# EAGLE design SK_1.0v (EAGLE 7.5.0)
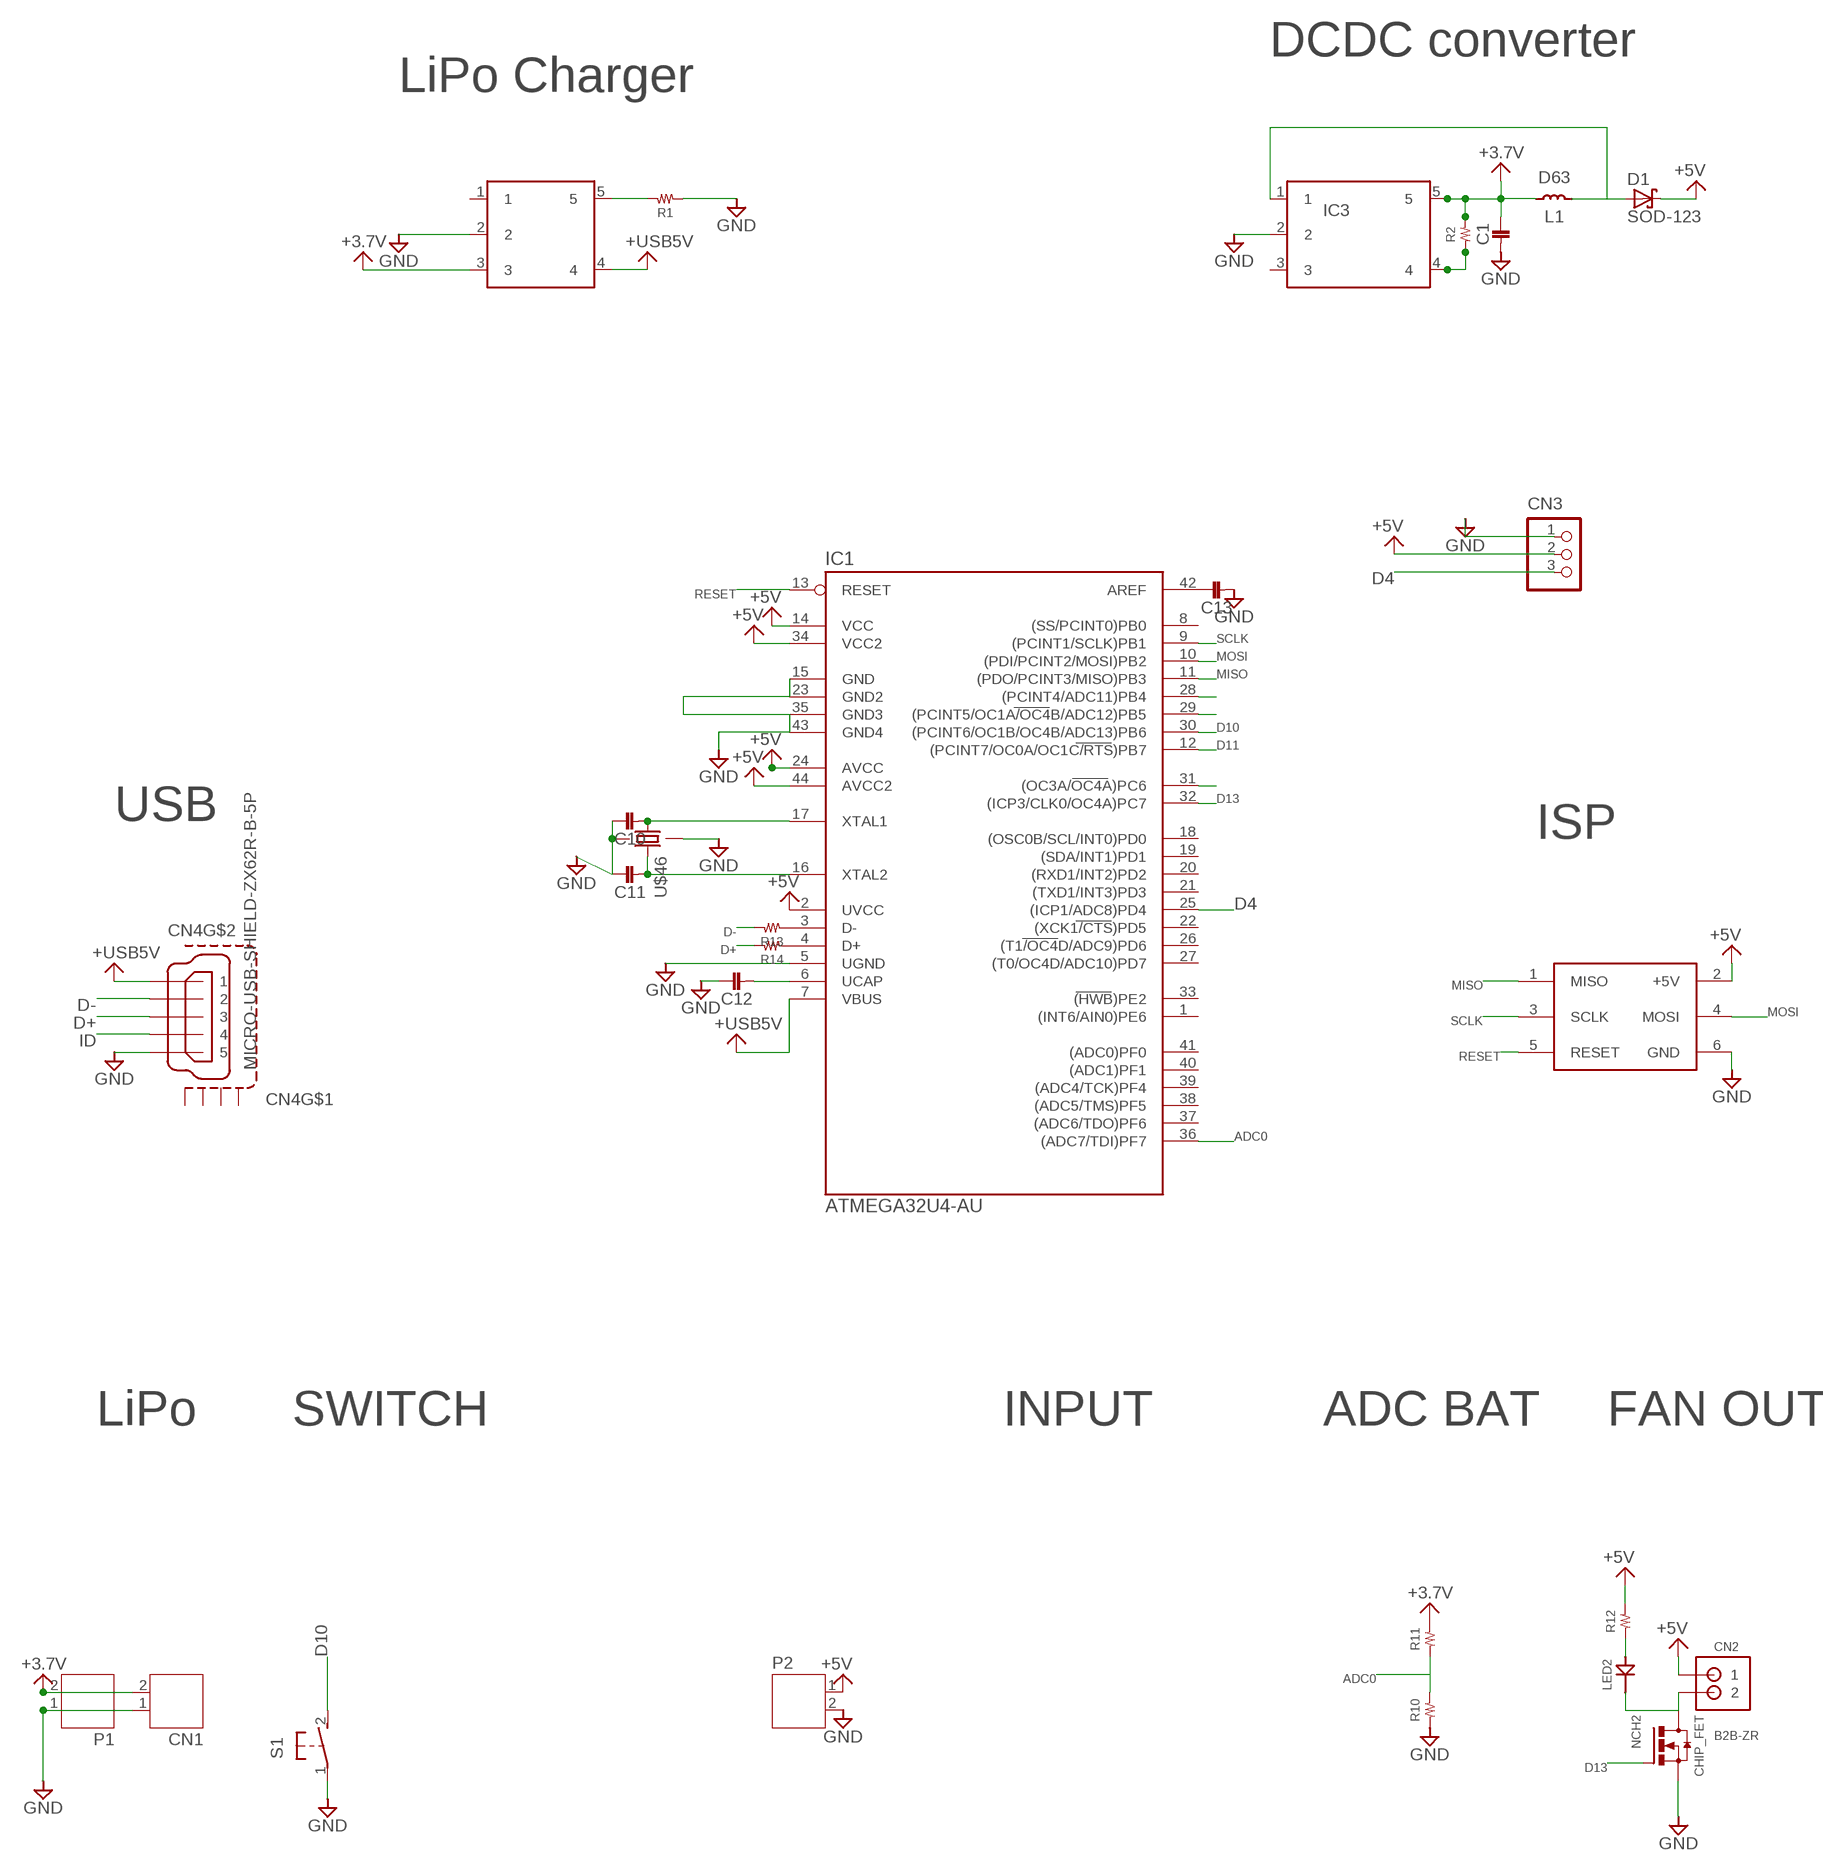
[diagram p0: schematic, sheet 1]

## Parts
C1  1608  [1608]
C10  1608  [1608]
C11  1608  [1608]
C12  1608  [1608]
C13  1608  [1608]
CN1  JST-PH2  [JST-PH2]
CN2  B2B-ZR  [B2B-ZR]
CN3  B3B-PH-K-S  [B3B-PH-K-S]
CN4  MICRO-USB-SHIELD-ZX62R-B-5P  [ZX62R-B-5P]
D1  SOD-123  [SOD_123]
IC1  ATMEGA32U4-AU  [TQFP44]
IC2  MCP73831  [SOT23-5L]
IC3  LM2735  [SOT23-5L]
L1  D63  [TOKO]
LED2  5MMLED  [5MM]
NCH2  CHIP_FET  [SOT23]
P1  JST-PH2  [JST-PH2]
P2  JST-PH2  [JST-PH2]
R1  RESISTOR__SMD  [1608]
R2  RESISTOR__SMD  [1608]
R10  RESISTOR__SMD  [1608]
R11  RESISTOR__SMD  [1608]
R12  RESISTOR__SMD  [1608]
R13  RESISTOR__SMD  [1608]
R14  RESISTOR__SMD  [1608]
S1  31-XX  [B3F-31XX]
U$3  ICSP  [ICSP]
U$46  FA-238  [FA-238]

## Nets
+3.7V: C1.P$1 CN1.2 IC2.3 IC3.5 L1.1 P1.2 R2.2 R11.2
+5V: CN2.1 CN3.2 D1.C IC1.2(UVCC) IC1.14(VCC) IC1.24(AVCC) IC1.34(VCC2) IC1.44(AVCC2) P2.1 R12.2 U$3.2(+5V)
+USB5V: CN4.1 IC1.7(VBUS) IC2.4
ADC0: IC1.36((ADC7/TDI)PF7) R10.2 R11.1
D4: CN3.3 IC1.25((ICP1/ADC8)PD4)
D10: IC1.30((PCINT6/OC1B/OC4B/ADC13)PB6) S1.2(S)
D11: IC1.12((PCINT7/OC0A/OC1C/RTS)PB7)
D13: IC1.32((ICP3/CLK0/OC4A)PC7) NCH2.1(G)
D+: CN4.3 R14.2
D-: CN4.2 R13.2
GND: C1.P$2 C10.P$1 C11.P$1 C12.P$1 C13.P$2 CN1.1 CN3.1 CN4.5 IC1.5(UGND) IC1.15(GND) IC1.23(GND2) IC1.35(GND3) IC1.43(GND4) IC2.2 IC3.2 NCH2.2(S) P1.1 P2.2 R1.1 R10.1 S1.1(P) U$3.6(GND) U$46.2 U$46.4
ID: CN4.4
MISO: IC1.11((PDO/PCINT3/MISO)PB3) U$3.1(MISO)
MOSI: IC1.10((PDI/PCINT2/MOSI)PB2) U$3.4(MOSI)
N$1: CN2.2 LED2.K NCH2.3(D)
N$2: IC2.5 R1.2
N$3: IC3.4 R2.1
N$4: D1.A IC3.1 L1.2
N$8: IC1.3(D-) R13.1
N$9: C13.P$1 IC1.42(AREF)
N$11: C10.P$2 IC1.17(XTAL1) U$46.1
N$12: LED2.A R12.1
N$13: C11.P$2 IC1.16(XTAL2) U$46.3
N$14: IC1.4(D+) R14.1
N$15: IC1.29((PCINT5/OC1A/OC4B/ADC12)PB5)
N$16: IC1.28((PCINT4/ADC11)PB4)
N$17: IC1.31((OC3A/OC4A)PC6)
N$18: C12.P$2 IC1.6(UCAP)
RESET: IC1.13(RESET) U$3.5(RESET)
SCLK: IC1.9((PCINT1/SCLK)PB1) U$3.3(SCLK)
Unconnected: CN4.M1(S1) CN4.M2(S2) CN4.M3(S3) CN4.M4(S4) IC1.1((INT6/AIN0)PE6) IC1.8((SS/PCINT0)PB0) IC1.18((OSC0B/SCL/INT0)PD0) IC1.19((SDA/INT1)PD1) IC1.20((RXD1/INT2)PD2) IC1.21((TXD1/INT3)PD3) IC1.22((XCK1/CTS)PD5) IC1.26((T1/OC4D/ADC9)PD6) IC1.27((T0/OC4D/ADC10)PD7) IC1.33((HWB)PE2) IC1.37((ADC6/TDO)PF6) IC1.38((ADC5/TMS)PF5) IC1.39((ADC4/TCK)PF4) IC1.40((ADC1)PF1) IC1.41((ADC0)PF0) IC2.1 IC3.3

## Notes on the sheet
- DCDC converter
- LiPo Charger
- USB
- ISP
- LiPo | SWITCH | INPUT | ADC BAT | FAN OUT

## Library data of the parts
C1 C10-C13 = 02_C:1608
CN1 = jst-ph (1):JST-PH2
CN2 = jst:B2B-ZR
CN3 = jst-ph:B3B-PH-*: Wire-to-Board 2.0mm pitch top mount connector Source: http://www.jst-mfg.com/product/pdf/jpn/PH.pdf http://www.jst-mfg.com/product/detail.php?series=199
CN4 = con-hirose1:MICRO-USB-SHIELD-: Hirose Micro USB Connector ZX62R-B-5P: Micro B, reverse (top mount) shell SMT Supplier: DigiKey H11574CT-ND Source: http://www.hirose.co.jp/cataloge_hp/e24200011.pdf
D1 = 15_DIODE:SOD-123
IC1 = mega32U4:ATMEGA32U4-AU
IC2 = 04_IC:MCP73831
IC3 = 04_IC:LM2735
L1 = 03_L:D63
LED2 = 10_LED:5MMLED
NCH2 = 06_FET:CHIP_FET
P1 P2 = jst-ph (2):JST-PH2
R1 R2 R10-R14 = 01_R:RESISTOR__SMD
S1 = switch-omron:31-XX: OMRON SWITCH; MPN: B3F-3100; OC_FARNELL: 959704; OC_NEWARK: 36M3582
U$3 = 08_CONECTOR:ICSP
U$46 = 09_2_CRYSTAL:FA-238

## Board
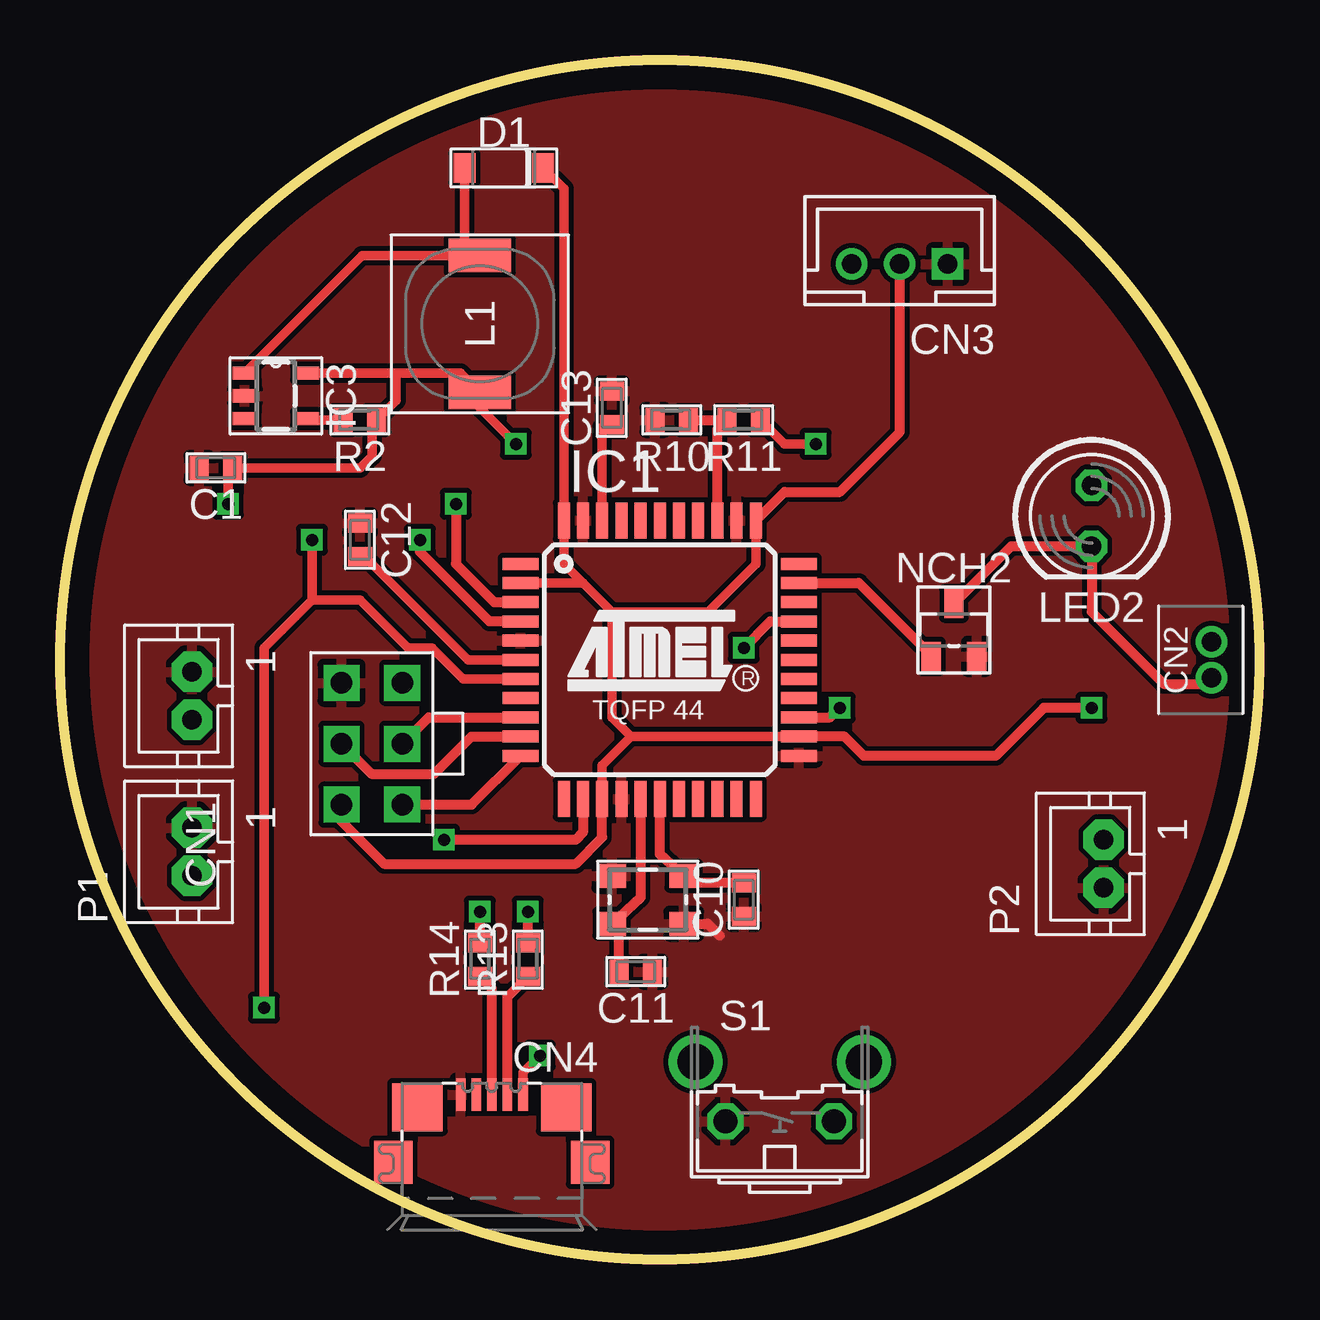
[diagram p1: board, top side]
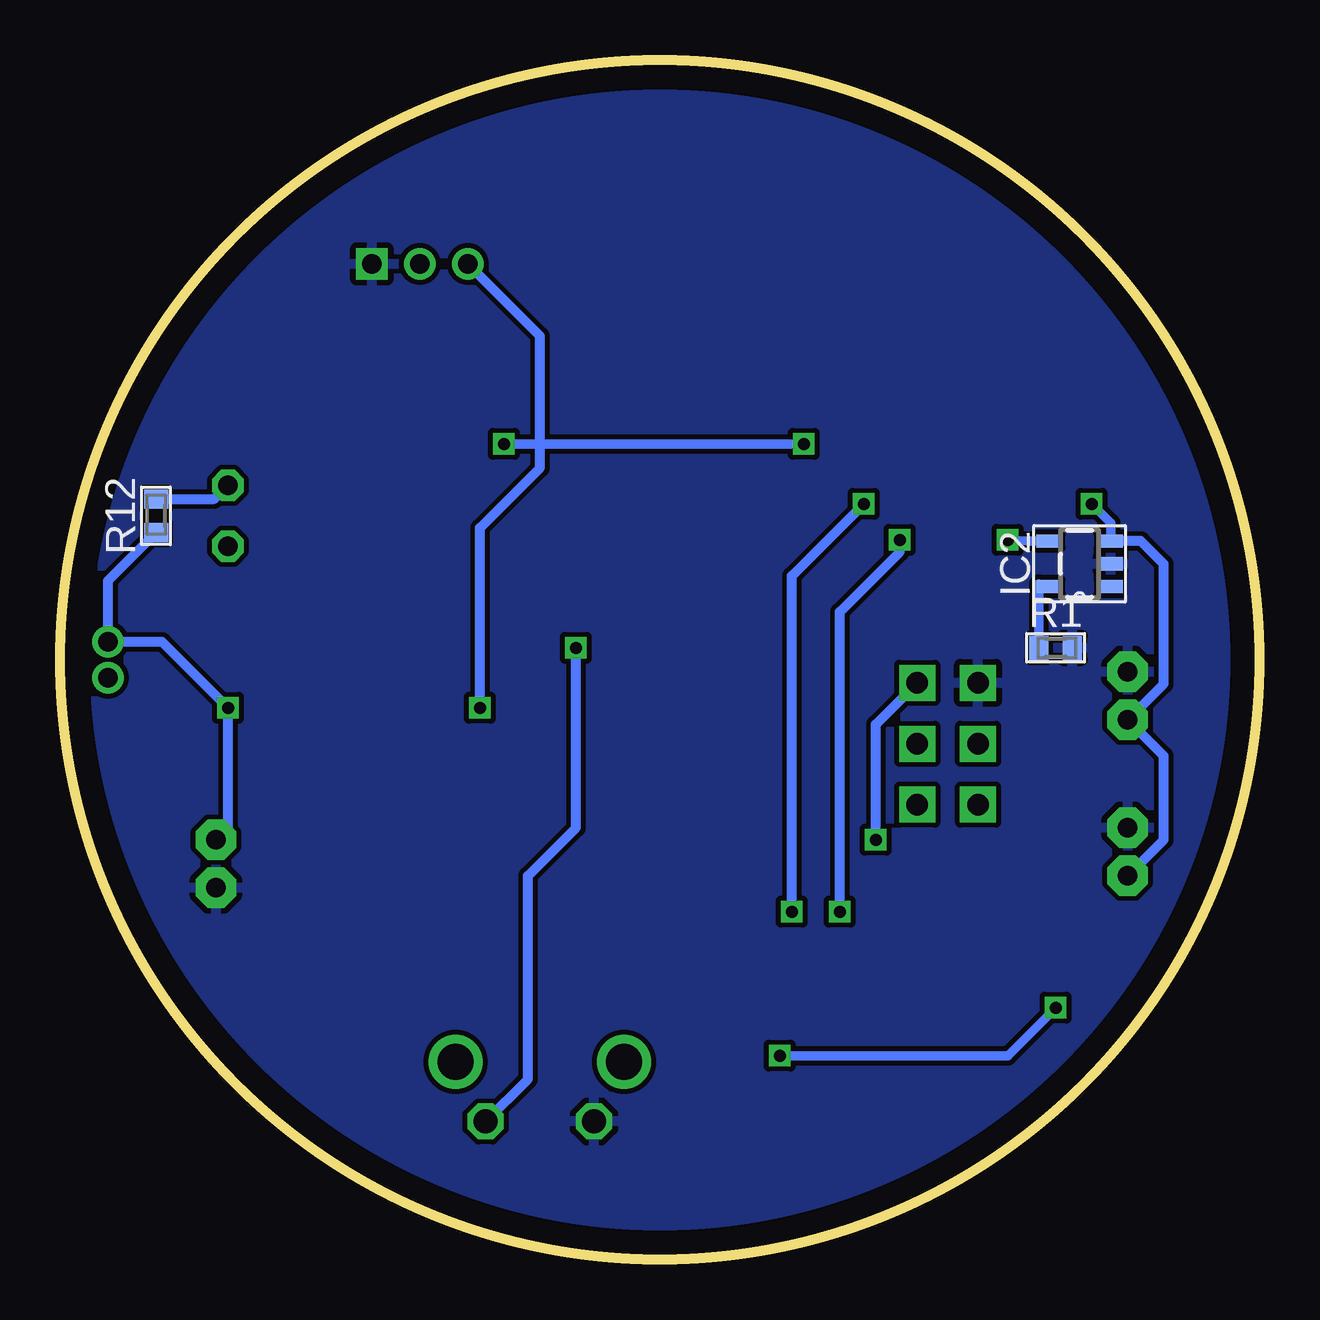
[diagram p2: board, bottom side, seen from below]

Size 50 x 50 mm. Coordinates in mm from the lower left corner, seen from the top.
Outline: circle at 25,25 radius 25
Copper layers (1*16): Top 0.035mm / dielectric 1.5mm / Bottom 0.035mm
Design rules "default": minimum track width 10mil, minimum drill 24mil, track to track 8mil, track to pad 8mil, pad to pad 8mil, via to via 8mil, smd to smd 8mil, copper to edge 40mil, drill to drill 8mil, minimum pad ring 10mil, minimum via ring 8mil, stop-mask expansion 4mil, vias tented up to drill 0mil, thermal gap 10mil

### Footprints (pad centres in the part's own frame; a part is rotated, then mirrored left to right if it is on the bottom)
1608 = smd 0.8 x 1: P$1 -0.7,0; P$2 0.7,0
JST-PH2 = drill 0.8 pad 1.676 octagon: 1 1,0; 2 -1,0
B2B-ZR = drill 0.8 pad 1.1: 1 -0.75,0; 2 0.75,0
B3B-PH-K-S = drill 0.8 square: 1 -2,0 | drill 0.8: 2 0,0; 3 2,0
ZX62R-B-5P = smd 1.35 x 0.4: 1 2.875,-1.3; 2 2.875,-0.65; 3 2.875,0; 4 2.875,0.65; 5 2.875,1.3 | smd 1.8 x 1.6: M1 0.05,-4.1; M2 0.05,4.1 | smd 2 x 2.1: M3 2.35,3.1; M4 2.35,-3.1
SOD_123 = smd 0.915 x 1.22: A -1.64,0; C 1.64,0
TQFP44 = smd 1.5 x 0.5: 1 -5.8,4; 2 -5.8,3.2; 3 -5.8,2.4; 4 -5.8,1.6; 5 -5.8,0.8; 6 -5.8,0; 7 -5.8,-0.8; 8 -5.8,-1.6; 9 -5.8,-2.4; 10 -5.8,-3.2; 11 -5.8,-4; 23 5.8,-4; 24 5.8,-3.2; 25 5.8,-2.4; 26 5.8,-1.6; 27 5.8,-0.8; 28 5.8,0; 29 5.8,0.8; 30 5.8,1.6; 31 5.8,2.4; 32 5.8,3.2; 33 5.8,4 | smd 0.5 x 1.5: 12 -4,-5.8; 13 -3.2,-5.8; 14 -2.4,-5.8; 15 -1.6,-5.8; 16 -0.8,-5.8; 17 0,-5.8; 18 0.8,-5.8; 19 1.6,-5.8; 20 2.4,-5.8; 21 3.2,-5.8; 22 4,-5.8; 34 4,5.8; 35 3.2,5.8; 36 2.4,5.8; 37 1.6,5.8; 38 0.8,5.8; 39 0,5.8; 40 -0.8,5.8; 41 -1.6,5.8; 42 -2.4,5.8; 43 -3.2,5.8; 44 -4,5.8
SOT23-5L = smd 0.55 x 1: 1 -0.95,-1.3; 2 0,-1.3; 3 0.95,-1.3; 4 0.95,1.3; 5 -0.95,1.3
TOKO = smd 1.4 x 2.6: 1 -2.85,0; 2 2.85,0
5MM = drill 0.8 octagon: A 0,-1.27; K 0,1.27
SOT23 = smd 0.8 x 1.2: 1 -0.95,-1.1; 2 0.95,-1.1; 3 0,1.1
1608' = smd 0.8 x 1: 1 -0.7,0; 2 0.7,0
B3F-31XX = drill 1 octagon: 1 -2.261,-1.245; 2 2.261,-1.245 | drill 1.5 pad 2.159: 3 -3.505,1.245; 4 3.505,1.245
ICSP = drill 0.9 pad 1.5 square: 1 -1.27,2.54; 2 1.27,2.54; 3 -1.27,0; 4 1.27,0; 5 -1.27,-2.54; 6 1.27,-2.54
FA-238 = smd 1.2 x 1: 1 -1.5,-1; 2 1.5,-1; 3 1.5,1; 4 -1.5,1

### Placement (x,y rotation side)
C1  6.5,33 180 top
C10  28.5,15 90 top
C11  24,12 180 top
C12  12.5,30 270 top
C13  23,35.5 90 top
CN1  5.5,23.5 90 top
CN2  48,25 270 top
CN3  35,41.5 180 top
CN4  18,4 90 top
D1  18.5,45.5 0 top
IC1  25,25 0 top
IC2  7.5,29 90 bottom
IC3  9,36 270 top
L1  17.5,39 90 top
LED2  43,31 180 top
NCH2  37.26,26.24 0 top
P1  5.5,17 90 top
P2  43.5,16.5 90 top
R1  [1608']  8.5,25.5 180 bottom
R2  [1608']  12.5,35 0 top
R10  [1608']  25.5,35 0 top
R11  [1608']  28.5,35 0 top
R12  [1608']  46,31 270 bottom
R13  [1608']  19.5,12.5 270 top
R14  [1608']  17.5,12.5 270 top
S1  30,7 0 top
U$3  13,21.5 180 top
U$46  24.5,15 180 top

### Tracks (layer width: path | path; a pad name or v marks a point on that pad's centre or on a via)
+3.7V  (via drill 0.5)
  Top 0.4: IC3.5 14,36.95 | 14,36.95 16.7,36.95 L1.1 17.5,35.5 v19,34 | 14,36.95 14,35.8 R2.2 13,34.8 13,33.5 12.5,33 C1.P$1 7,32.8 v7,31.5 | v31.5,34 30.2,34 R11.2
  Bottom 0.4: IC2.3 6.2,30.7 v7,31.5 | v19,34 v31.5,34
  Bottom 0.406: P1.2 4,17.5 4,21 CN1.2 4,24 4,29 4.95,29.95 IC2.3
+5V  (via drill 0.5)
  Top 0.4: IC1.24 23.8,21.8 | 23.8,21.8 22.6,20.6 IC1.14 | 23.8,21.8 23,22.6 23,27 | 23,27 21.8,28.2 | 21.8,28.2 IC1.2 | 21.8,28.2 21,29 IC1.44 21,44.64 D1.C | 23,27 27,27 29,29 IC1.34
  Top 0.406: U$3.2 11.73,18.27 13.5,16.5 21.5,16.5 22.6,17.6 IC1.14 | v43,23 41,23 39,21 33.5,21 32.7,21.8 IC1.24 | IC1.34 30.2,32 32.5,32 35,34.5 CN3.2
  Bottom 0.406: R12.2 48,28.3 CN2.1 45.75,25.75 v43,23 43,18 P2.1
+USB5V  (via drill 0.5)
  Top 0.4: CN4.1 19.3,7.8 v20,8.5 | v8.5,10.5 8.5,25.5 10.5,27.5 | 10.5,27.5 12.5,27.5 14.5,25.5 15.5,25.5 16.8,24.2 IC1.7 | v10.5,30 10.5,27.5
  Bottom 0.4: v20,8.5 10.5,8.5 v8.5,10.5 | IC2.4 9.55,29.95 v10.5,30
ADC0
  Top 0.406: IC1.36 27.4,34.6 R11.1 R10.2
D4  (via drill 0.5)
  Top 0.406: IC1.25 32.1,22.6 v32.5,23
  Bottom 0.406: v32.5,23 32.5,30.5 30,33 30,38.5 CN3.3
D10  (via drill 0.5)
  Top 0.406: v28.5,25.5 29.6,26.6 IC1.30
  Bottom 0.406: S1.2 30.5,7.52 30.5,16 28.5,18 v28.5,25.5
D13
  Top 0.406: IC1.32 33.3,28.2 36.31,25.19 NCH2.1
D+
  Top 0.406: CN4.3 18,11.3 R14.2
D-
  Top 0.406: CN4.2 18.65,10.95 R13.2
GND
  Top 0.406: U$46.4 27,14 27.5,13.5
  pour Bottom: 25,50 arc90 0,25 arc90 25,0 arc90 50,25 arc90
  pour Top: 25,50 arc90 0,25 arc90 25,0 arc90 50,25 arc90
MISO
  Top 0.406: U$3.1 17.16,18.96 IC1.11
MOSI
  Top 0.406: U$3.4 12.98,20.25 15.6,20.25 17.15,21.8 IC1.10
N$1
  Top 0.406: NCH2.3 39.65,29.73 LED2.K 43,27 46,24 47.75,24 CN2.2
N$2
  Bottom 0.4: R1.2 9.2,28.15 IC2.5
N$3
  Top 0.4: IC3.4 10.35,35 R2.1
N$4
  Top 0.4: IC3.1 12.6,41.85 L1.2 16.86,42.49 D1.A
N$8  (via drill 0.5)
  Top 0.406: R13.1 v19.5,14.5 | v16.5,31.5 16.5,29 18.1,27.4 IC1.3
  Bottom 0.406: v19.5,14.5 19.5,28.5 v16.5,31.5
N$9
  Top 0.4: IC1.42 22.6,34.7 C13.P$1
N$11
  Top 0.406: IC1.17 25,16.9 U$46.1 26.2,15.7 C10.P$2
N$12
  Bottom 0.406: R12.1 43.57,31.7 LED2.A
N$13
  Top 0.406: IC1.16 24.2,15.1 U$46.3 23.3,13.8 C11.P$2
N$14  (via drill 0.5)
  Top 0.406: R14.1 v17.5,14.5 | IC1.4 17.9,26.6 15,29.5 v15,30
  Bottom 0.406: v17.5,14.5 17.5,27 15,29.5 v15,30
N$18
  Top 0.4: IC1.6 17,25 12.7,29.3 C12.P$2
RESET  (via drill 0.5)
  Top 0.406: IC1.13 21.8,17.8 21.5,17.5 v16,17.5
  Bottom 0.406: v16,17.5 16,22.31 U$3.5
SCLK
  Top 0.406: U$3.3 15.37,22.6 IC1.9